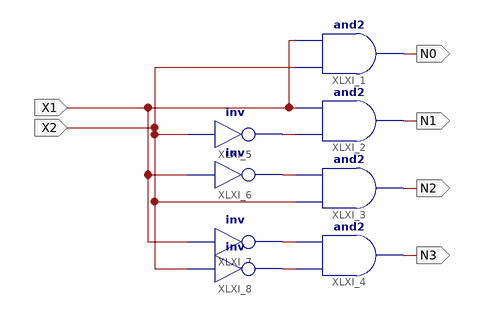
[diagram p0: schematic sheet 1]
// Xilinx ISE schematic bin7seg_anx.sch (spartan3e) as structural Verilog: 8 symbols, 6 ports
module bin7seg_anx (
  input  X1,
  input  X2,
  output N0,
  output N1,
  output N2,
  output N3
);

  wire XLXN_1, XLXN_2, XLXN_3, XLXN_4;

  and XLXI_1 (N0, X2, X1);
  and XLXI_2 (N1, XLXN_1, X1);
  and XLXI_3 (N2, X2, XLXN_2);
  and XLXI_4 (N3, XLXN_4, XLXN_3);
  not XLXI_5 (XLXN_1, X2);
  not XLXI_6 (XLXN_2, X1);
  not XLXI_7 (XLXN_3, X1);
  not XLXI_8 (XLXN_4, X2);
endmodule
